# EAGLE design KGM IOExpander v1.0 (EAGLE 5.11)
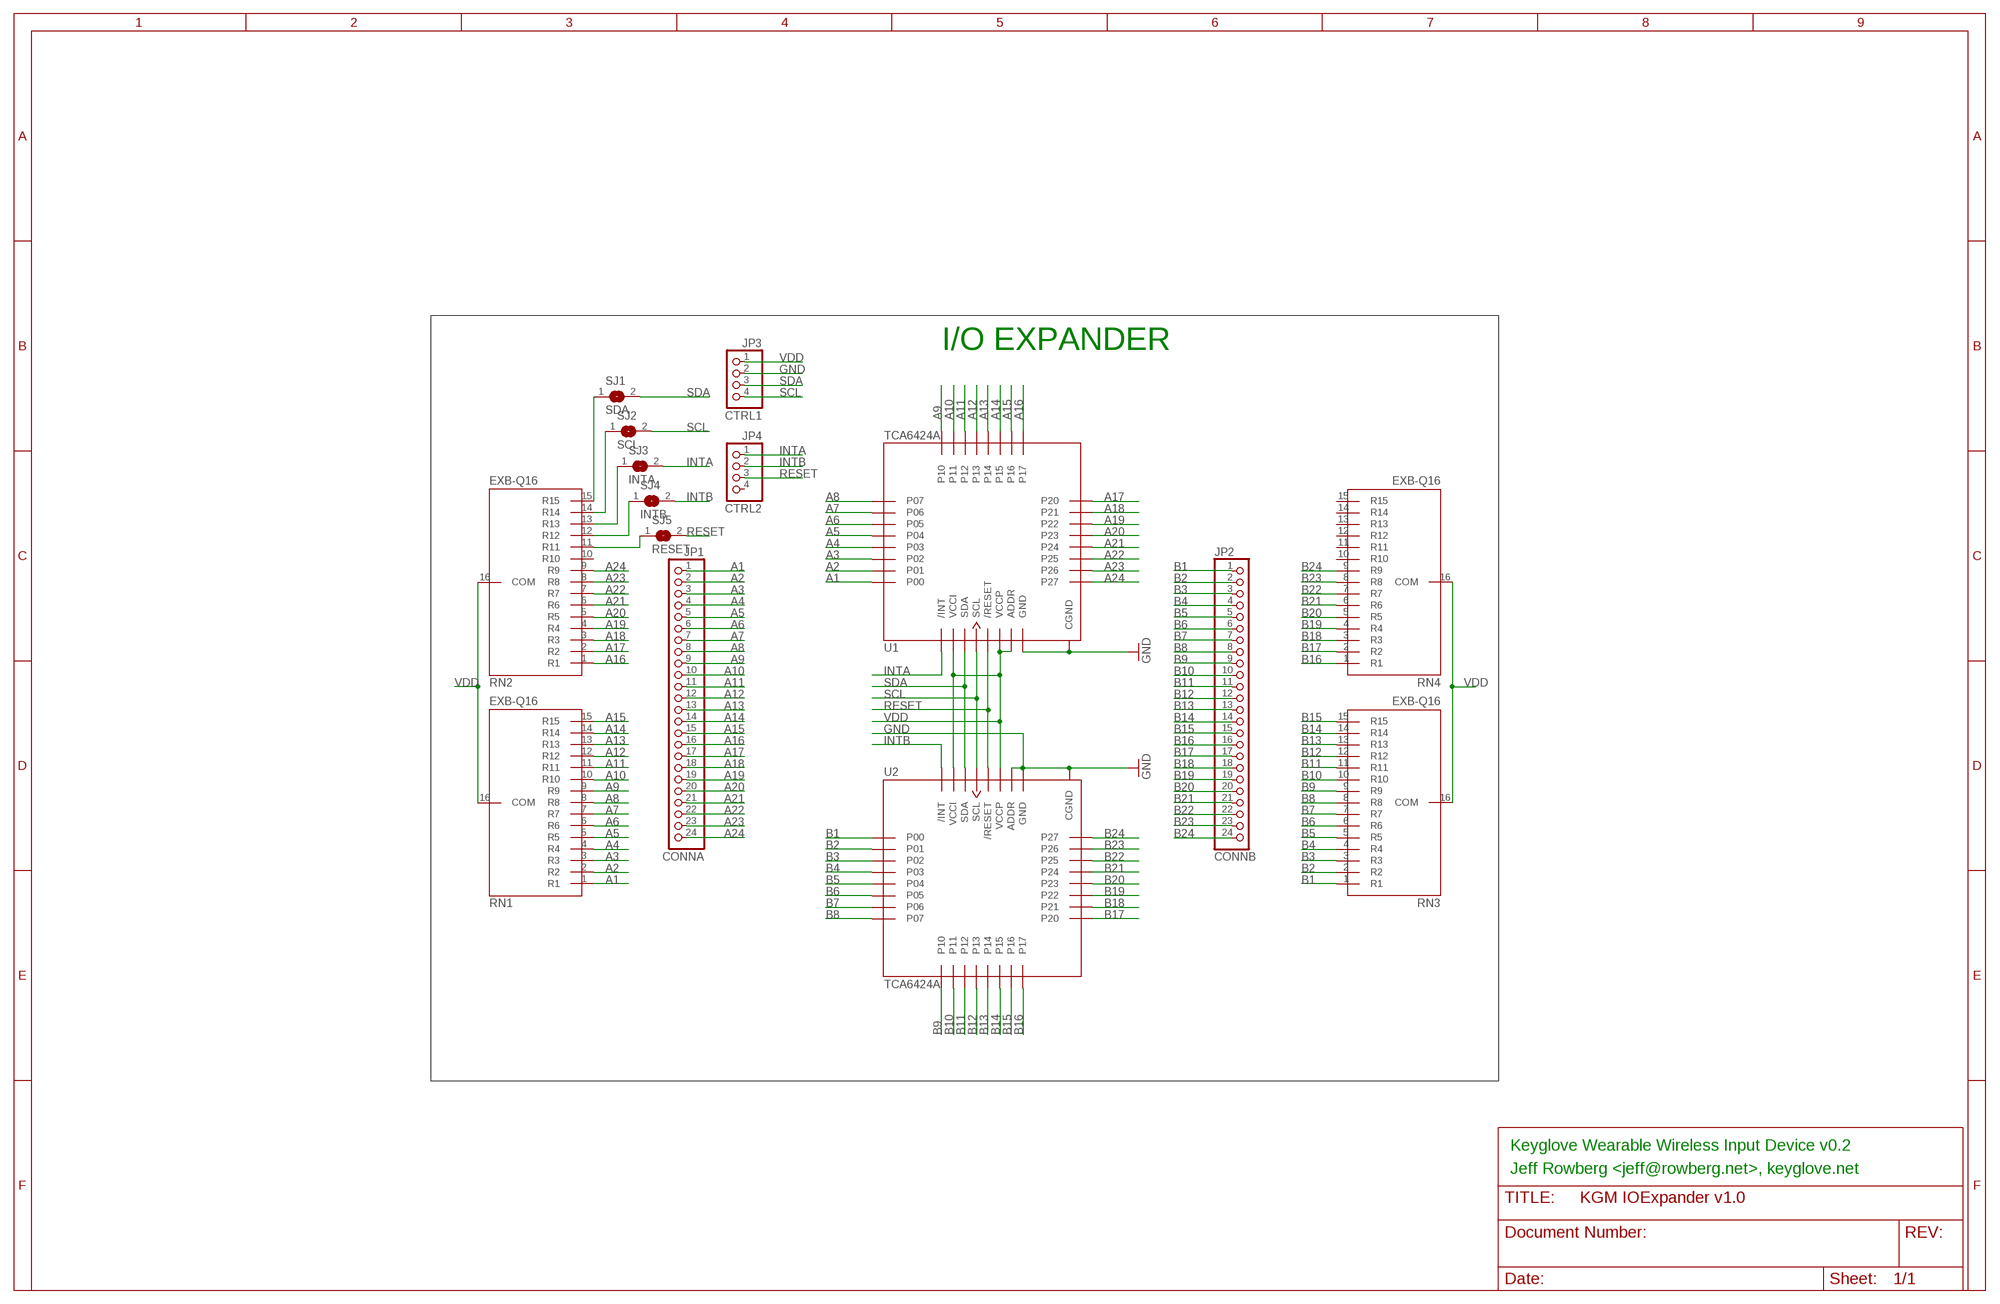
[diagram p0: schematic, sheet 1]

## Parts
JP1  CONNA  PINHD-1X24  [1X24]
JP2  CONNB  PINHD-1X24  [1X24]
JP3  CTRL1  PINHD-1X4  [1X04]
JP4  CTRL2  PINHD-1X4  [1X04]
RN1  EXB-Q16  [SMD1506]
RN2  EXB-Q16  [SMD1506]
RN3  EXB-Q16  [SMD1506]
RN4  EXB-Q16  [SMD1506]
SJ1  SDA  SJ  [SJ]
SJ2  SCL  SJ  [SJ]
SJ3  INTA  SJ  [SJ]
SJ4  INTB  SJ  [SJ]
SJ5  RESET  SJ  [SJ]
U1  TCA6424A  [QFN32]
U2  TCA6424A  [QFN32]

## Nets
A1: JP1.1 RN1.1(R1) U1.1(P00)
A2: JP1.2 RN1.2(R2) U1.2(P01)
A3: JP1.3 RN1.3(R3) U1.3(P02)
A4: JP1.4 RN1.4(R4) U1.4(P03)
A5: JP1.5 RN1.5(R5) U1.5(P04)
A6: JP1.6 RN1.6(R6) U1.6(P05)
A7: JP1.7 RN1.7(R7) U1.7(P06)
A8: JP1.8 RN1.8(R8) U1.8(P07)
A9: JP1.9 RN1.9(R9) U1.9(P10)
A10: JP1.10 RN1.10(R10) U1.10(P11)
A11: JP1.11 RN1.11(R11) U1.11(P12)
A12: JP1.12 RN1.12(R12) U1.12(P13)
A13: JP1.13 RN1.13(R13) U1.13(P14)
A14: JP1.14 RN1.14(R14) U1.14(P15)
A15: JP1.15 RN1.15(R15) U1.15(P16)
A16: JP1.16 RN2.1(R1) U1.16(P17)
A17: JP1.17 RN2.2(R2) U1.17(P20)
A18: JP1.18 RN2.3(R3) U1.18(P21)
A19: JP1.19 RN2.4(R4) U1.19(P22)
A20: JP1.20 RN2.5(R5) U1.20(P23)
A21: JP1.21 RN2.6(R6) U1.21(P24)
A22: JP1.22 RN2.7(R7) U1.22(P25)
A23: JP1.23 RN2.8(R8) U1.23(P26)
A24: JP1.24 RN2.9(R9) U1.24(P27)
B1: JP2.1 RN3.1(R1) U2.1(P00)
B2: JP2.2 RN3.2(R2) U2.2(P01)
B3: JP2.3 RN3.3(R3) U2.3(P02)
B4: JP2.4 RN3.4(R4) U2.4(P03)
B5: JP2.5 RN3.5(R5) U2.5(P04)
B6: JP2.6 RN3.6(R6) U2.6(P05)
B7: JP2.7 RN3.7(R7) U2.7(P06)
B8: JP2.8 RN3.8(R8) U2.8(P07)
B9: JP2.9 RN3.9(R9) U2.9(P10)
B10: JP2.10 RN3.10(R10) U2.10(P11)
B11: JP2.11 RN3.11(R11) U2.11(P12)
B12: JP2.12 RN3.12(R12) U2.12(P13)
B13: JP2.13 RN3.13(R13) U2.13(P14)
B14: JP2.14 RN3.14(R14) U2.14(P15)
B15: JP2.15 RN3.15(R15) U2.15(P16)
B16: JP2.16 RN4.1(R1) U2.16(P17)
B17: JP2.17 RN4.2(R2) U2.17(P20)
B18: JP2.18 RN4.3(R3) U2.18(P21)
B19: JP2.19 RN4.4(R4) U2.19(P22)
B20: JP2.20 RN4.5(R5) U2.20(P23)
B21: JP2.21 RN4.6(R6) U2.21(P24)
B22: JP2.22 RN4.7(R7) U2.22(P25)
B23: JP2.23 RN4.8(R8) U2.23(P26)
B24: JP2.24 RN4.9(R9) U2.24(P27)
GND [power]: JP3.2 U1.25(GND) U1.EP(CGND) U2.25(GND) U2.26(ADDR) U2.EP(CGND)
INTA: JP4.1 SJ3.2 U1.32(/INT)
INTB: JP4.2 SJ4.2 U2.32(/INT)
N$1: RN2.15(R15) SJ1.1
N$2: RN2.14(R14) SJ2.1
N$3: RN2.13(R13) SJ3.1
N$4: RN2.12(R12) SJ4.1
N$5: RN2.11(R11) SJ5.1
RESET: JP4.3 SJ5.2 U1.28(/RESET) U2.28(/RESET)
SCL: JP3.4 SJ2.2 U1.29(SCL) U2.29(SCL)
SDA: JP3.3 SJ1.2 U1.30(SDA) U2.30(SDA)
VDD [power]: JP3.1 RN1.16(COM) RN2.16(COM) RN3.16(COM) RN4.16(COM) U1.26(ADDR) U1.27(VCCP) U1.31(VCCI) U2.27(VCCP) U2.31(VCCI)
Unconnected: JP4.4 RN2.10(R10) RN4.10(R10) RN4.11(R11) RN4.12(R12) RN4.13(R13) RN4.14(R14) RN4.15(R15)

## Notes on the sheet
- I/O EXPANDER
- Keyglove Wearable Wireless Input Device v0.2
- Jeff Rowberg <jeff@rowberg.net>, keyglove.net

## Library data of the parts
JP1 JP2 = sf-pinhead:PINHD-1X24: PIN HEADER
JP3 JP4 = sf-pinhead:PINHD-1X4: PIN HEADER
RN1-RN4 = sf-keyglove:EXB-Q16
SJ1-SJ5 = jumper:SJ: SMD solder JUMPER
U1 U2 = sf-keyglove:TCA6424A

## Net classes
0 default: width 0.152 mm, drill 0.305 mm, clearance 0.152 mm
1 power: width 0.254 mm, drill 0.305 mm, clearance 0.152 mm

## Board
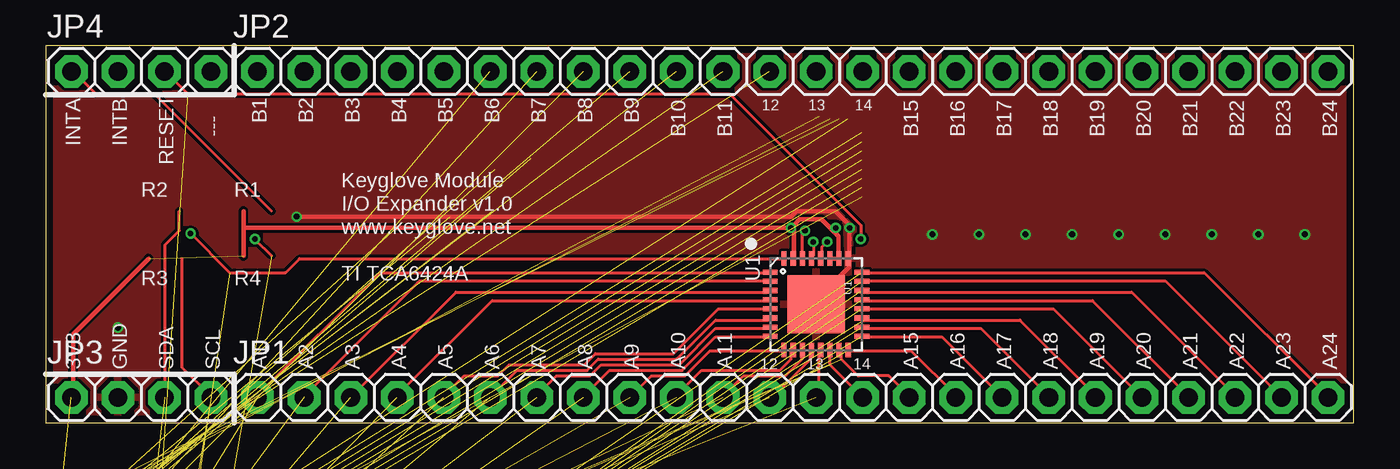
[diagram p1: board, top side]
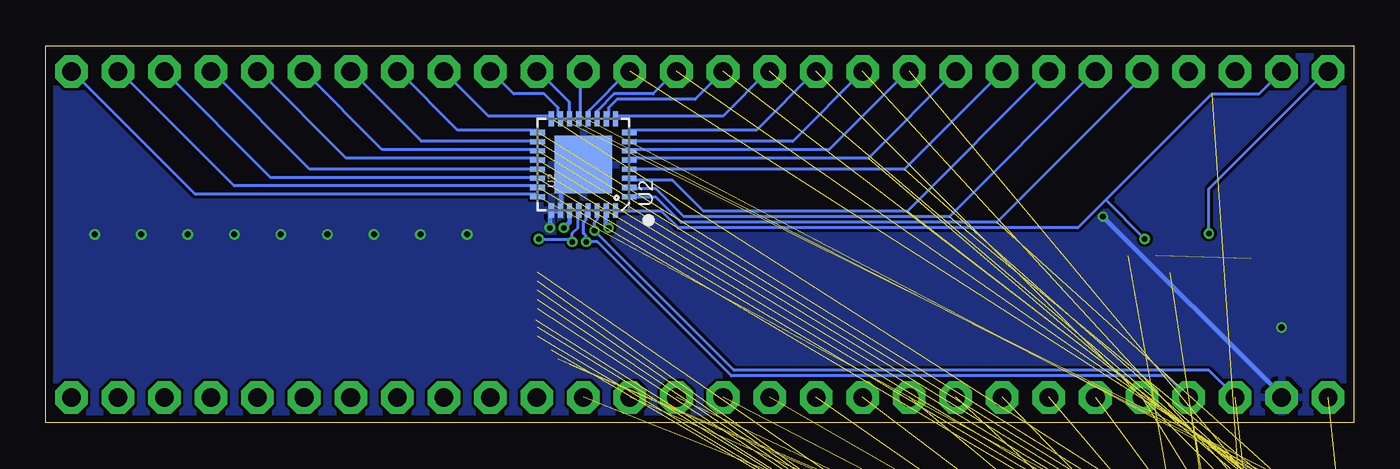
[diagram p2: board, bottom side, seen from below]

Size 71.37 x 20.57 mm. Coordinates in mm from the lower left corner, seen from the top.
Outline: 0,0 71.37,0 71.37,20.57 0,20.57 0,0
Copper layers (1*16): Top 0.0356mm / dielectric 1.5011mm / Bottom 0.0356mm
Design rules "PCBWingOrder *": minimum track width 6mil, minimum drill 12mil, track to track 6mil, track to pad 6mil, pad to pad 6mil, via to via 6mil, smd to smd 6mil, copper to edge 15mil, drill to drill 6mil, minimum pad ring 6mil, minimum via ring 5mil, stop-mask expansion 4mil, vias tented up to drill 20mil, thermal gap 10mil

### Footprints (pad centres in the part's own frame; a part is rotated, then mirrored left to right if it is on the bottom)
1X24 = drill 1.016 pad 1.778 octagon: 1 -29.21,0; 2 -26.67,0; 3 -24.13,0; 4 -21.59,0; 5 -19.05,0; 6 -16.51,0; 7 -13.97,0; 8 -11.43,0; 9 -8.89,0; 10 -6.35,0; 11 -3.81,0; 12 -1.27,0; 13 1.27,0; 14 3.81,0; 15 6.35,0; 16 8.89,0; 17 11.43,0; 18 13.97,0; 19 16.51,0; 20 19.05,0; 21 21.59,0; 22 24.13,0; 23 26.67,0; 24 29.21,0
1X04 = drill 1.016 pad 1.778 octagon: 1 -3.81,0; 2 -1.27,0; 3 1.27,0; 4 3.81,0
SMD1506 = smd 0.3 x 0.6: 1 -1.75,-0.8; 2 -1.25,-0.8; 3 -0.75,-0.8; 4 -0.25,-0.8; 5 0.25,-0.8; 6 0.75,-0.8; 7 1.25,-0.8; 8 1.75,-0.8; 9 1.75,0.8; 10 1.25,0.8; 11 0.75,0.8; 12 0.25,0.8; 13 -0.25,0.8; 14 -0.75,0.8; 15 -1.25,0.8; 16 -1.75,0.8
SJ = smd 1.168 x 1.6: 1 -0.762,0; 2 0.762,0
QFN32 = smd 0.285 x 0.8: 1 -1.75,-2.5; 2 -1.25,-2.5; 3 -0.75,-2.5; 4 -0.25,-2.5; 5 0.25,-2.5; 6 0.75,-2.5; 7 1.25,-2.5; 8 1.75,-2.5; 17 1.75,2.5; 18 1.25,2.5; 19 0.75,2.5; 20 0.25,2.5; 21 -0.25,2.5; 22 -0.75,2.5; 23 -1.25,2.5; 24 -1.75,2.5 | smd 0.8 x 0.285: 9 2.5,-1.75; 10 2.5,-1.25; 11 2.5,-0.75; 12 2.5,-0.25; 13 2.5,0.25; 14 2.5,0.75; 15 2.5,1.25; 16 2.5,1.75; 25 -2.5,1.75; 26 -2.5,1.25; 27 -2.5,0.75; 28 -2.5,0.25; 29 -2.5,-0.25; 30 -2.5,-0.75; 31 -2.5,-1.25; 32 -2.5,-1.75 | smd 3.15 x 3.15: EP 0,0

### Placement (x,y rotation side)
JP1  40.77,1.4 0 top
JP2  40.77,19.18 0 top
JP3  5.21,1.4 0 top
JP4  5.21,19.18 0 top
RN1  2.54,-15.24 0 top  (outside the outline)
RN2  2.54,-20.32 0 top  (outside the outline)
RN3  2.54,-5.08 0 top  (outside the outline)
RN4  2.54,-10.16 0 top  (outside the outline)
SJ1  2.54,-26.67 0 top  (outside the outline)
SJ2  2.54,-31.75 0 top  (outside the outline)
SJ3  2.54,-36.83 0 top  (outside the outline)
SJ4  2.54,-41.91 0 top  (outside the outline)
SJ5  2.54,-46.99 0 top  (outside the outline)
U1  42.04,6.48 270 top
U2  42.04,14.1 90 bottom

### Tracks (layer width: path | path; a pad name or v marks a point on that pad's centre or on a via)
A1  (1 unrouted)
  Top 0.152: U1.1 39.45,8.2 18.26,8.2 11.56,1.5 JP1.1
A2  (1 unrouted)
  Top 0.152: U1.2 39.45,7.75 20.4,7.75 14.15,1.5 JP1.2
A3  (1 unrouted)
  Top 0.152: U1.3 39.45,7.14 22.38,7.14 JP1.3
A4  (1 unrouted)
  Top 0.152: U1.4 39.45,6.68 24.36,6.68 19.18,1.5 JP1.4
A5  (1 unrouted)
  Top 0.152: U1.5 39.45,6.22 36.7,6.22 34.27,3.79 30,3.79 29.39,3.17 25.27,3.17 24.66,2.56 22.84,2.56 21.77,1.5 JP1.5
A6  (1 unrouted)
  Top 0.152: U1.6 39.45,5.61 36.55,5.61 34.42,3.48 30.15,3.48 29.54,2.87 25.73,2.87 JP1.6
A7  (1 unrouted)
  Top 0.152: U1.7 39.45,5.16 36.55,5.16 34.57,3.17 30.3,3.17 29.69,2.56 27.86,2.56 26.8,1.5 JP1.7
A8  (1 unrouted)
  Top 0.152: U1.8 39.45,4.7 36.55,4.7 34.72,2.87 30.76,2.87 29.39,1.5 JP1.8
A9  (1 unrouted)
  Top 0.152: U1.9 40.21,3.94 36.25,3.94 34.87,2.56 33.05,2.56 JP1.9
A10  (1 unrouted)
  Top 0.152: U1.10 40.66,3.94 40.66,3.48 40.06,2.87 35.79,2.87 34.42,1.5 JP1.10
A11  (1 unrouted)
  Top 0.152: U1.11 41.27,3.94 41.27,3.48 40.36,2.56 38.08,2.56 37.01,1.5 JP1.11
A12  (1 unrouted)
  Top 0.152: U1.12 41.73,3.94 41.73,3.48 39.6,1.35 JP1.12
A13  (1 unrouted)
  Top 0.152: U1.13 42.19,3.94 42.19,1.65 42.04,1.5 JP1.13
A14  (1 unrouted)
  Top 0.152: U1.14 42.8,3.94 42.8,3.17 JP1.14
A15  (1 unrouted)
  Top 0.152: U1.15 43.41,3.94 43.41,3.48 44.32,2.56 46,2.56 47.07,1.5 JP1.15
A16  (1 unrouted)
  Top 0.152: U1.16 43.87,3.94 47.22,3.94 49.66,1.5 JP1.16
A17  (1 unrouted)
  Top 0.152: U1.17 44.63,4.7 48.9,4.7 JP1.17
A18  (1 unrouted)
  Top 0.152: U1.18 44.63,5.16 51.03,5.16 54.69,1.5 JP1.18
A19  (1 unrouted)
  Top 0.152: U1.19 44.63,5.61 53.16,5.61 57.28,1.5 JP1.19
A20  (1 unrouted)
  Top 0.152: U1.20 44.63,6.22 54.99,6.22 JP1.20
A21  (1 unrouted)
  Top 0.152: U1.21 44.63,6.68 57.12,6.68 62.31,1.5 JP1.21
A22  (1 unrouted)
  Top 0.152: U1.22 44.63,7.14 59.26,7.14 64.9,1.5 JP1.22
A23  (1 unrouted)
  Top 0.152: U1.23 44.63,7.75 61.09,7.75 JP1.23
A24  (1 unrouted)
  Top 0.152: U1.24 44.63,8.2 63.22,8.2 69.93,1.5 JP1.24
B1  (1 unrouted)
  Bottom 0.152: JP2.1 11.56,18.87 19.48,10.95 36.7,10.95 38.08,12.32 39.45,12.32 U2.1
B2  (1 unrouted)
  Bottom 0.152: U2.2 39.45,12.78 38.08,12.78 36.55,11.25 22.07,11.25 14.15,19.18 JP2.2
B3  (1 unrouted)
  Bottom 0.152: U2.3 39.45,13.23 37.16,13.23 35.48,11.56 24.36,11.56 16.74,19.18 JP2.3
B4  (1 unrouted)
  Bottom 0.152: JP2.4 24.51,13.84 39.45,13.84 U2.4
B5  (1 unrouted)
  Bottom 0.152: U2.5 39.45,14.45 26.49,14.45 21.77,19.18 JP2.5
B6  (1 unrouted)
  Bottom 0.152: U2.6 39.45,14.91 28.63,14.91 24.36,19.18 JP2.6
B7  (1 unrouted)
  Bottom 0.152: JP2.7 30.61,15.37 39.45,15.37 U2.7
B8  (1 unrouted)
  Bottom 0.152: U2.8 39.45,15.98 32.59,15.98 29.39,19.18 JP2.8
B9  (1 unrouted)
  Bottom 0.152: U2.9 40.21,16.74 34.42,16.74 31.98,19.18 JP2.9
B10  (1 unrouted)
  Bottom 0.152: JP2.10 35.94,17.65 40.21,17.65 40.66,17.2 40.66,16.74 U2.10
B11  (1 unrouted)
  Bottom 0.152: U2.11 41.27,16.74 41.27,17.04 40.36,17.96 38.23,17.96 37.01,19.18 JP2.11
B12  (1 unrouted)
  Bottom 0.152: U2.12 41.73,16.74 41.73,17.04 39.6,19.18 JP2.12
B13  (1 unrouted)
  Bottom 0.152: JP2.13 42.19,19.02 42.19,16.74 U2.13
B14  (1 unrouted)
  Bottom 0.152: U2.14 42.8,16.74 42.8,17.5 44.48,19.18 JP2.14
B15  (1 unrouted)
  Bottom 0.152: U2.15 43.41,16.74 43.41,17.2 44.17,17.96 45.85,17.96 47.07,19.18 JP2.15
B16  (1 unrouted)
  Bottom 0.152: JP2.16 47.22,16.74 43.87,16.74 U2.16
B17  (1 unrouted)
  Bottom 0.152: U2.17 44.63,15.98 48.9,15.98 52.09,19.18 JP2.17
B18  (1 unrouted)
  Bottom 0.152: U2.18 44.63,15.37 50.88,15.37 54.69,19.18 JP2.18
B19  (1 unrouted)
  Bottom 0.152: JP2.19 53.01,14.91 44.63,14.91 U2.19
B20  (1 unrouted)
  Bottom 0.152: U2.20 44.63,14.45 54.99,14.45 59.72,19.18 JP2.20
B21  (1 unrouted)
  Bottom 0.152: U2.21 44.63,13.84 56.97,13.84 62.31,19.18 JP2.21
B22  (1 unrouted)
  Bottom 0.152: JP2.22 59.11,13.39 44.63,13.39 U2.22
B23  (1 unrouted)
  Bottom 0.152: U2.23 44.63,12.93 61.09,12.93 67.33,19.18 JP2.23
B24  (1 unrouted)
  Bottom 0.152: U2.24 44.63,12.47 63.22,12.47 69.93,19.18 JP2.24
GND  (via drill 0.3, 0.33)
  Top 0.254: U1.EP 42.04,6.68 43.87,8.51 43.87,8.97 U1.25 43.87,9.12 v43.87,10.64 43.87,10.79 43.1,11.56 40.97,11.56 40.66,11.25 v13.69,11.25
  Bottom 0.254: U2.EP 42.04,13.99 43.26,12.78 43.26,11.71 U2.26 43.41,11.56 43.71,11.56 U2.25 43.87,11.56 v43.87,10.64 | v13.69,11.25 3.94,1.5 JP3.2
  other vias: 48.39,10.29 50.93,10.29 53.47,10.29 56.01,10.29 58.55,10.29 61.09,10.29 63.63,10.29 66.17,10.29 68.71,10.29 3.94,5.21
  pour Bottom: 0.38,20.19 70.99,20.19 70.99,0.38 0.38,0.38
  pour Top: 0.38,20.19 70.99,20.19 70.99,0.38 0.38,0.38
INTA  (via drill 0.3)  (1 unrouted)
  Top 0.152: v7.9,10.34 10.03,8.2 13.08,8.2 13.84,8.97 40.21,8.97 U1.32 | 12.32,11.56 5.92,17.96 2.72,17.96 1.5,19.18 JP4.1
  Bottom 0.152: v7.9,10.34 7.9,12.78 1.5,19.18 JP4.1
INTB  (via drill 0.3)  (1 unrouted)
  Top 0.152: v11.4,10.03 12.32,9.12
  Bottom 0.152: 13.54,12.17 7.75,17.96 5.16,17.96 JP4.2 | 13.54,12.17 15.06,10.64 36.85,10.64 37.77,11.56 40.21,11.56 U2.32 | v11.4,10.03 13.54,12.17
N$1  (1 unrouted)
N$2  (1 unrouted)
N$3  (1 unrouted)
N$4  (1 unrouted)
N$5  (1 unrouted)
RESET  (via drill 0.3)  (1 unrouted)
  Top 0.152: v42.65,9.88 42.34,9.58 42.34,9.12 U1.28 | v44.48,10.03 44.48,10.79 37.31,17.96 7.75,17.96 6.53,19.18 JP4.3
  Bottom 0.152: 42.65,10.03 42.65,10.34 42.34,10.64 42.34,11.56 U2.28 | v44.48,10.03 42.65,10.03 | 42.65,10.03 v42.65,9.88
SCL  (via drill 0.3)  (1 unrouted)
  Top 0.152: v41.88,9.88 41.88,9.12 U1.29 | 7.44,8.97 7.44,3.02 8.97,1.5 JP3.4
  Bottom 0.152: U2.29 41.88,11.56 41.88,11.1 42.04,10.95 42.04,10.34 41.88,10.19 v41.88,9.88 41.27,9.88 33.96,2.56 10.19,2.56 JP3.4
SDA  (via drill 0.3)  (1 unrouted)
  Top 0.152: v41.43,10.49 41.27,10.34 41.27,9.12 U1.30 | 7.29,11.56 7.29,10.49 6.53,9.73 6.53,1.5 JP3.3
  Bottom 0.152: U2.30 41.27,11.56 41.27,11.1 41.43,10.95 v41.43,10.49 33.81,2.87 7.9,2.87 6.53,1.5 JP3.3
VDD  (via drill 0.3)  (5 unrouted)
  Top 0.254: 40.82,10.64 40.82,10.79 41.12,11.1 42.34,11.1 42.88,10.57 | 40.82,10.64 40.82,9.12 U1.31 | 42.88,10.57 43.26,10.19 43.26,9.12 U1.26 43.26,8.97 42.8,8.97 U1.27 | 40.82,10.64 v40.66,10.64 10.79,10.64 | v43.1,10.64 42.95,10.64 42.88,10.57 | 10.79,10.64 10.79,11.56 | 10.79,9.12 10.79,10.64 | 5.61,8.97 1.5,4.85 1.5,1.5 JP3.1
  Bottom 0.254: v40.66,10.64 40.82,10.79 40.82,11.56 U2.31 | v43.1,10.64 42.8,10.95 42.8,11.56 U2.27

### Text on the board
tPlace: 12 | 13 | 14 | --- | B1 | B2 | B3 | B4 | B5 | B6 | B7 | B8 | B9 | B10 | B11 | B15 | B16 | B17 | B18 | B19 | B20 | B21 | B22 | B23 | B24 | INTA | INTB | RESET | Keyglove Module | R2 | R1 | I/O Expander v1.0 | www.keyglove.net | TI TCA6424A | U1 | R3 | R4 | 3V3 | GND | SDA | SCL | A1 | A2 | A3 | A4 | A5 | A6 | A7 | A8 | A9 | A10 | A11 | 12 | 13 | 14 | A15 | A16 | A17 | A18 | A19 | A20 | A21 | A22 | A23 | A24
bPlace: U2